# EAGLE design kijelző (EAGLE 6.5.0)
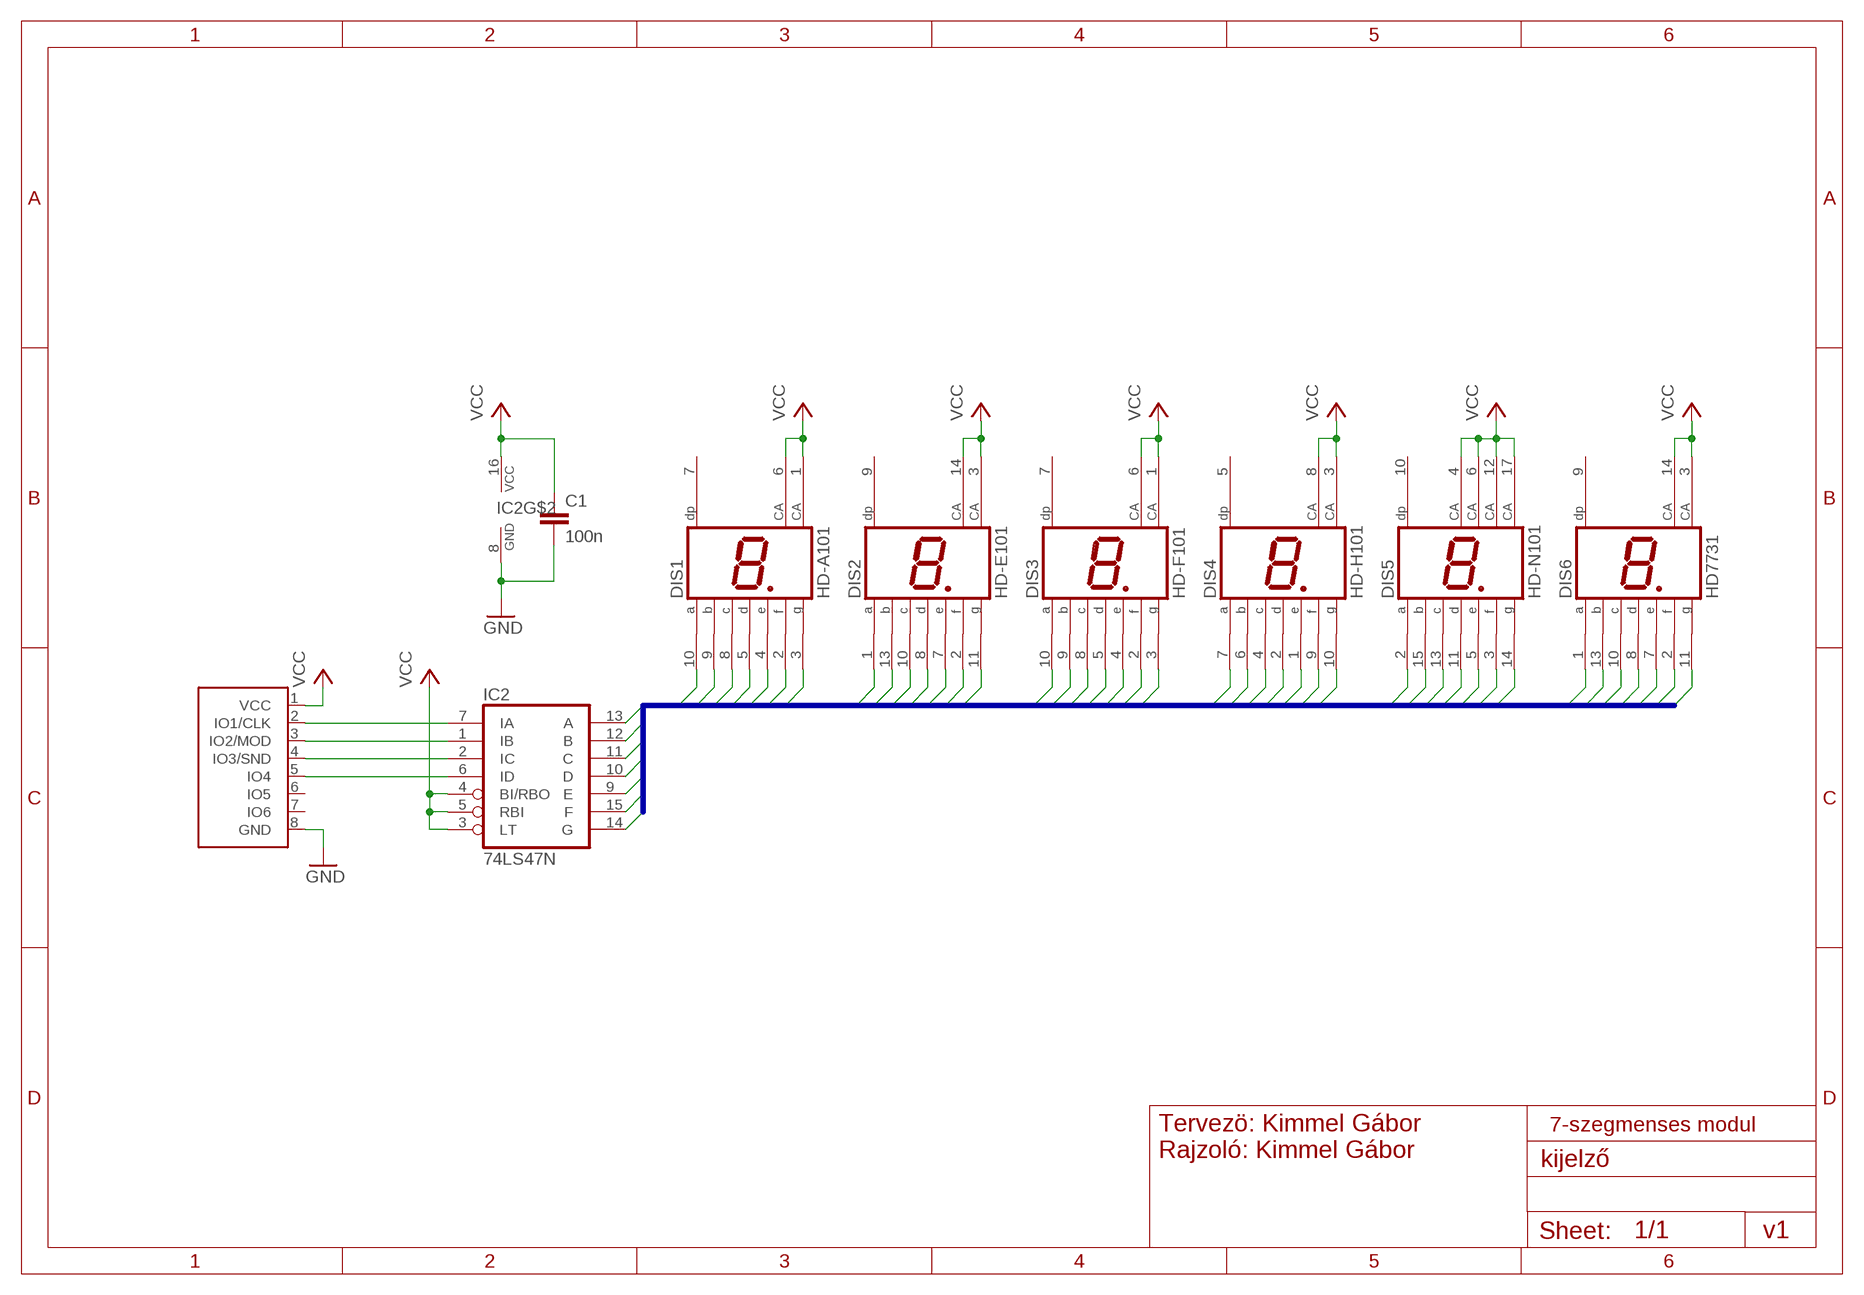
[diagram p0: schematic, sheet 1]

## Parts
C1  100n  C-EU075-032X103  [C075-032X103]
DIS1  HD-A101  [HDSP-A]
DIS2  HD-E101  [HDSP-I]
DIS3  HD-F101  [HDSP-E]
DIS4  HD-H101  [HDSP-M]
DIS5  HD-N101  [HDSP-Q]
DIS6  HD7731  [HD7730]
IC2  74LS47N  [DIL16]
U$1  GANZ-CONNECTOR  [FE08W]

## Nets
A: DIS1.10(A) DIS2.1(A) DIS3.10(A) DIS4.7(A) DIS5.2(A) DIS6.1(A) IC2.13(A)
B: DIS1.9(B) DIS2.13(B) DIS3.9(B) DIS4.6(B) DIS5.15(B) DIS6.13(B) IC2.12(B)
C: DIS1.8(C) DIS2.10(C) DIS3.8(C) DIS4.4(C) DIS5.13(C) DIS6.10(C) IC2.11(C)
D: DIS1.5(D) DIS2.8(D) DIS3.5(D) DIS4.2(D) DIS5.11(D) DIS6.8(D) IC2.10(D)
E: DIS1.4(E) DIS2.7(E) DIS3.4(E) DIS4.1(E) DIS5.5(E) DIS6.7(E) IC2.9(E)
F: DIS1.2(F) DIS2.2(F) DIS3.2(F) DIS4.9(F) DIS5.3(F) DIS6.2(F) IC2.15(F)
G: DIS1.3(G) DIS2.11(G) DIS3.3(G) DIS4.10(G) DIS5.14(G) DIS6.11(G) IC2.14(G)
GND: C1.2 IC2.8(GND) U$1.8(GND)
N$1: IC2.7(IA) U$1.2(IO1/CLK)
N$2: IC2.1(IB) U$1.3(IO2/MOD)
N$3: IC2.2(IC) U$1.4(IO3/SND)
N$4: IC2.6(ID) U$1.5(IO4)
VCC: C1.1 DIS1.1(CA) DIS1.6(CA) DIS2.3(CA) DIS2.14(CA) DIS3.1(CA) DIS3.6(CA) DIS4.3(CA) DIS4.8(CA) DIS5.4(CA) DIS5.6(CA) DIS5.12(CA) DIS5.17(CA) DIS6.3(CA) DIS6.14(CA) IC2.3(LT) IC2.4(BI/RBO) IC2.5(RBI) IC2.16(VCC) U$1.1(VCC)
Unconnected: DIS1.7(DP) DIS2.9(DP) DIS3.7(DP) DIS4.5(DP) DIS5.10(DP) DIS6.9(DP) U$1.6(IO5) U$1.7(IO6)

## Buses
A,B,C,D,E,F,G

## Notes on the sheet
- Tervezö: Kimmel Gábor
  Rajzoló: Kimmel Gábor
- 7-szegmenses modul
- v1

## Library data of the parts
C1 = resistor:C-EU: CAPACITOR, European symbol
DIS1 = display-hp:HD-A101: LED DISPLAY 1-character 7 segment, decimal point right; OC_FARNELL: unknown; OC_NEWARK: unknown
DIS2 = display-hp:HD-E101: LED DISPLAY 1-character 7 segment, decimal point right; OC_FARNELL: unknown; OC_NEWARK: unknown
DIS3 = display-hp:HD-F101: LED DISPLAY 1-character 7 segment, decimal point right; OC_FARNELL: unknown; OC_NEWARK: unknown
DIS4 = display-hp:HD-H101: LED DISPLAY 1-character 7 segment, decimal point right; OC_FARNELL: unknown; OC_NEWARK: unknown
DIS5 = display-hp:HD-N101: LED DISPLAY 1-character 7 segment, decimal point right; OC_FARNELL: unknown; OC_NEWARK: unknown
DIS6 = display-hp:HD7731: LED DISPLAY 1-character 7 segment, decimal point right; OC_FARNELL: unknown; OC_NEWARK: unknown
IC2 = 74xx-eu:74*47: BCD to seven segment DECODER/DRIVER Source: http://www.ee.washington.edu/stores/DataSheets/74ls/74ls47.pdf
U$1 = ganzlib:GANZ-CONNECTOR

## Board
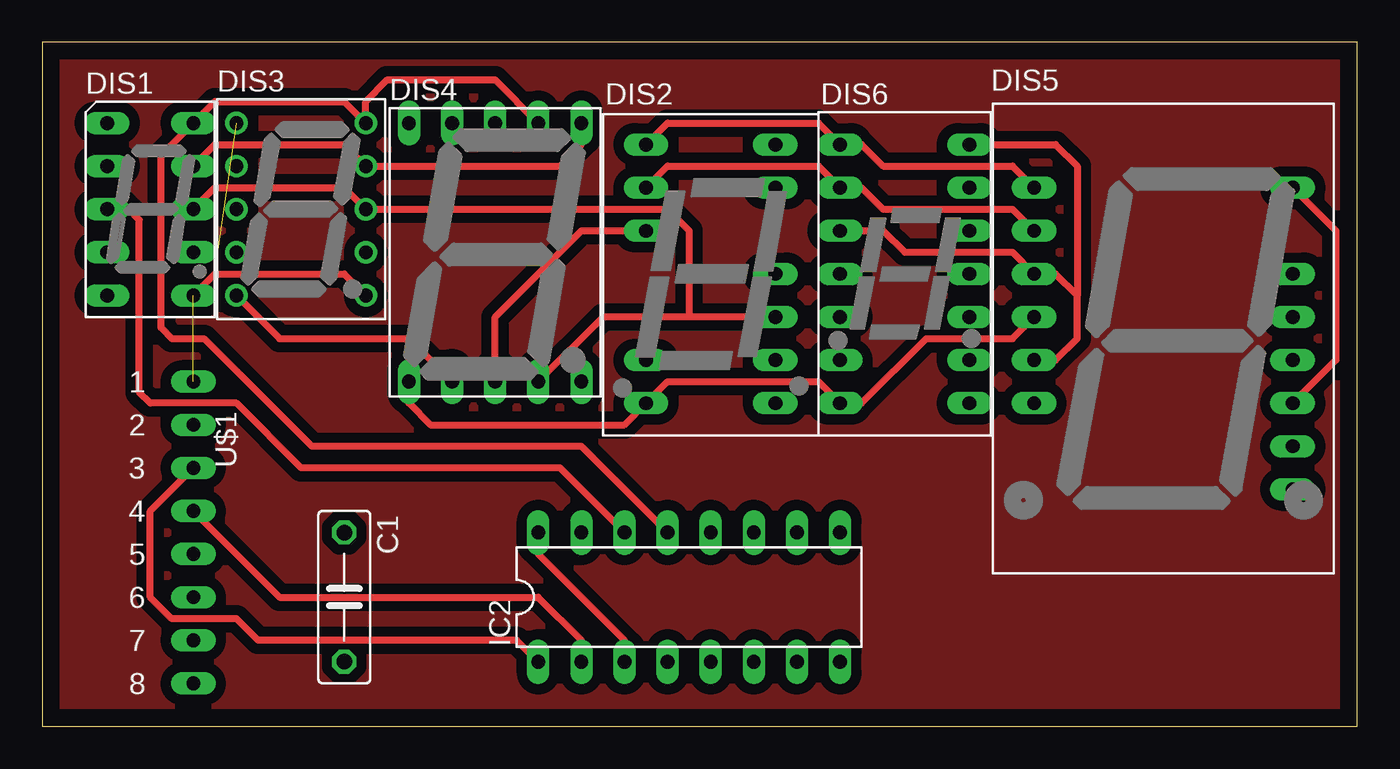
[diagram p1: board, top side]
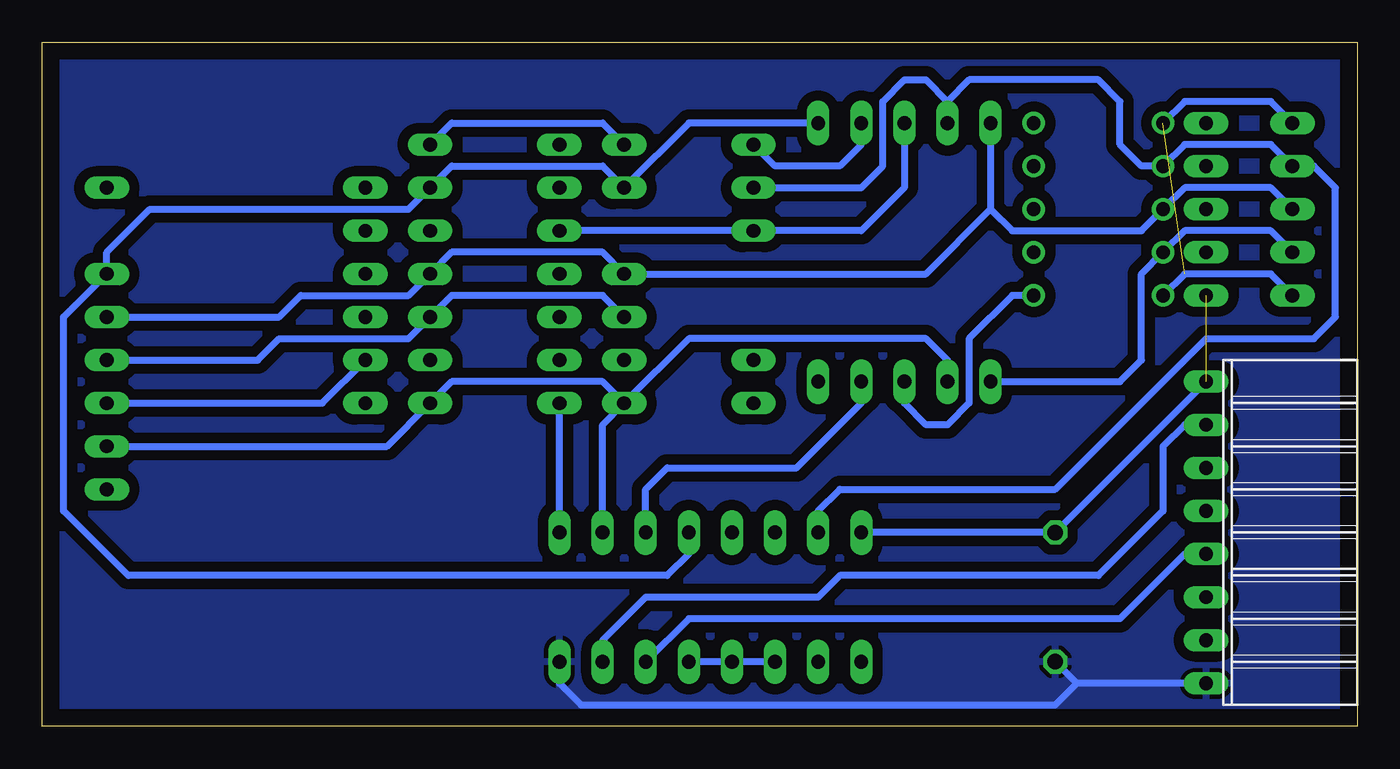
[diagram p2: board, bottom side, seen from below]

Size 77.45 x 40.31 mm. Coordinates in mm from the lower left corner, seen from the top.
Outline: 0,0 77.45,0 77.45,40.31 0,40.31 0,0
Copper layers (1*16): Top 0.035mm / dielectric 1.5mm / Bottom 0.035mm
Design rules "default": minimum track width 10mil, minimum drill 24mil, track to track 8mil, track to pad 8mil, pad to pad 8mil, via to via 8mil, smd to smd 8mil, copper to edge 40mil, drill to drill 8mil, minimum pad ring 10mil, minimum via ring 8mil, stop-mask expansion 4mil, vias tented up to drill 0mil, thermal gap 10mil

### Footprints (pad centres in the part's own frame; a part is rotated, then mirrored left to right if it is on the bottom)
C075-032X103 = drill 0.914 octagon: 1 -3.81,0; 2 3.81,0
HDSP-A = drill 0.813 long: 1 -2.54,5.08; 2 -2.54,2.54; 3 -2.54,0; 4 -2.54,-2.54; 5 -2.54,-5.08; 6 2.54,-5.08; 7 2.54,-2.54; 8 2.54,0; 9 2.54,2.54; 10 2.54,5.08
HDSP-I = drill 0.813 long: 1 -3.81,7.62; 2 -3.81,5.08; 3 -3.81,2.54; 6 -3.81,-5.08; 7 -3.81,-7.62; 8 3.81,-7.62; 9 3.81,-5.08; 10 3.81,-2.54; 11 3.81,0; 13 3.81,5.08; 14 3.81,7.62
HDSP-E = drill 0.813: 1 -3.81,5.08; 2 -3.81,2.54; 3 -3.81,0; 4 -3.81,-2.54; 5 -3.81,-5.08; 6 3.81,-5.08; 7 3.81,-2.54; 8 3.81,0; 9 3.81,2.54; 10 3.81,5.08
HDSP-M = drill 0.813 long: 1 -5.08,-7.62; 2 -2.54,-7.62; 3 0,-7.62; 4 2.54,-7.62; 5 5.08,-7.62; 6 5.08,7.62; 7 2.54,7.62; 8 0,7.62; 9 -2.54,7.62; 10 -5.08,7.62
HDSP-Q = drill 0.813 long: 2 -7.62,8.89; 3 -7.62,6.35; 4 -7.62,3.81; 5 -7.62,1.27; 6 -7.62,-1.27; 7 -7.62,-3.81; 10 7.62,-8.89; 11 7.62,-6.35; 12 7.62,-3.81; 13 7.62,-1.27; 14 7.62,1.27; 15 7.62,3.81; 17 7.62,8.89
HD7730 = drill 0.813 long: 1 -3.81,7.62; 2 -3.81,5.08; 3 -3.81,2.54; 4 -3.81,0; 5 -3.81,-2.54; 6 -3.81,-5.08; 7 -3.81,-7.62; 8 3.81,-7.62; 9 3.81,-5.08; 10 3.81,-2.54; 11 3.81,0; 12 3.81,2.54; 13 3.81,5.08; 14 3.81,7.62
DIL16 = drill 0.813 long: 1 -8.89,-3.81; 2 -6.35,-3.81; 3 -3.81,-3.81; 4 -1.27,-3.81; 5 1.27,-3.81; 6 3.81,-3.81; 7 6.35,-3.81; 8 8.89,-3.81; 9 8.89,3.81; 10 6.35,3.81; 11 3.81,3.81; 12 1.27,3.81; 13 -1.27,3.81; 14 -3.81,3.81; 15 -6.35,3.81; 16 -8.89,3.81
FE08W = drill 0.813 long: 1 0,8.89; 2 0,6.35; 3 0,3.81; 4 0,1.27; 5 0,-1.27; 6 0,-3.81; 7 0,-6.35; 8 0,-8.89

### Placement (x,y rotation side)
C1  17.78,7.62 270 top
DIS1  6.35,30.48 0 top
DIS2  39.37,26.67 0 top
DIS3  15.24,30.48 0 top
DIS4  26.67,27.94 0 top
DIS5  66.04,22.86 0 top
DIS6  50.8,26.67 0 top
IC2  38.1,7.62 0 top
U$1  8.89,11.43 0 top

### Tracks (layer width: path | path; a pad name or v marks a point on that pad's centre or on a via)
A
  Top 0.406: DIS5.2 57.15,33.02 49.53,33.02 48.26,34.29 DIS6.1 45.72,35.56 36.83,35.56 DIS2.1 | DIS4.7 26.67,38.1 20.32,38.1 19.05,36.83 DIS3.10 17.78,36.83 10.16,36.83 DIS1.10 6.99,33.66 6.99,23.5 7.62,22.86 9.53,22.86 15.88,16.51 31.75,16.51 IC2.13
  Bottom 0.406: DIS4.7 29.21,34.29 30.48,33.02 34.29,33.02 DIS2.1
B
  Top 0.406: DIS1.9 10.16,34.29 17.78,34.29 DIS3.9 30.48,33.02 31.75,34.29 DIS4.6
  Bottom 0.406: IC2.12 39.37,10.16 40.64,8.89 72.39,8.89 76.2,12.7 76.2,24.13 DIS5.15 73.66,27.94 71.12,30.48 55.88,30.48 DIS6.13 53.34,33.02 44.45,33.02 DIS2.13 39.37,35.56 DIS4.6
C
  Top 0.406: DIS1.8 10.16,31.75 17.78,31.75 DIS3.8 36.83,30.48 38.1,29.21 38.1,24.13 | DIS2.10 38.1,24.13 | 38.1,24.13 33.02,24.13 DIS4.4
  Bottom 0.406: IC2.11 41.91,13.97 40.64,15.24 33.02,15.24 29.21,19.05 DIS4.4 | DIS5.13 64.77,21.59 63.5,22.86 55.88,22.86 DIS6.10 53.34,25.4 44.45,25.4 DIS2.10
D
  Top 0.406: DIS3.5 13.97,22.86 21.59,22.86 DIS4.2
  Bottom 0.406: IC2.10 44.45,17.78 DIS2.8 | DIS1.5 5.08,26.67 10.16,26.67 DIS3.5 | DIS5.11 57.15,16.51 DIS6.8 53.34,20.32 44.45,20.32 DIS2.8 | DIS4.2 24.13,21.59 25.4,22.86 39.37,22.86 DIS2.8
E
  Top 0.406: DIS5.5 57.15,22.86 52.07,22.86 48.26,19.05 DIS6.7 45.72,20.32 36.83,20.32 DIS2.7 34.29,17.78 22.86,17.78 21.59,19.05 DIS4.1
  Bottom 0.406: IC2.9 DIS6.7 | DIS1.4 5.08,29.21 10.16,29.21 DIS3.4 12.7,26.67 12.7,21.59 13.97,20.32 DIS4.1
F
  Top 0.406: DIS5.3 57.15,30.48 49.53,30.48 48.26,31.75 DIS6.2 45.72,33.02 36.83,33.02 DIS2.2
  Bottom 0.406: IC2.15 31.75,12.7 30.48,13.97 17.78,13.97 8.89,22.86 2.54,22.86 1.27,24.13 1.27,31.75 2.54,33.02 DIS1.2 5.08,34.29 10.16,34.29 DIS3.2 12.7,33.02 13.97,34.29 13.97,36.83 15.24,38.1 22.86,38.1 24.13,36.83 | DIS2.2 29.21,31.75 27.94,33.02 27.94,36.83 26.67,38.1 25.4,38.1 24.13,36.83 | 24.13,36.83 DIS4.9
G
  Top 0.406: IC2.14 30.48,15.24 15.24,15.24 11.43,19.05 6.35,19.05 5.71,19.68 5.71,29.84 5.08,30.48 DIS1.3
  Bottom 0.406: DIS1.3 5.08,31.75 10.16,31.75 DIS3.3 12.7,29.21 20.32,29.21 21.59,30.48 | DIS5.14 63.5,24.13 62.23,25.4 55.88,25.4 DIS6.11 53.34,27.94 44.45,27.94 DIS2.11 25.4,26.67 21.59,30.48 | DIS4.10 21.59,30.48
GND
  Bottom 0.406: U$1.8 16.51,2.54 | 16.51,2.54 C1.2 | IC2.8 46.99,2.54 45.72,1.27 17.78,1.27 16.51,2.54
  pour Bottom (isolate 0.61): 0,40.64 77.47,40.64 77.47,0 0,0
N$1
  Bottom 0.406: U$1.2 10.16,17.78 11.43,16.51 11.43,12.7 15.24,8.89 30.48,8.89 31.75,7.62 41.91,7.62 44.45,5.08 IC2.7
N$2
  Top 0.406: IC2.1 27.94,5.08 12.7,5.08 11.43,6.35 7.62,6.35 6.35,7.62 6.35,12.7 U$1.3
N$3
  Top 0.406: U$1.4 13.97,7.62 29.21,7.62 31.75,5.08 IC2.2
N$4
  Bottom 0.406: U$1.5 10.16,10.16 13.97,6.35 39.37,6.35 IC2.6
N$5
  pour Top (isolate 0.61): 0,0 0,40.64 77.47,40.64 77.47,0
VCC  (2 unrouted)
  Top 0.406: IC2.3 34.29,5.08 29.21,10.16 IC2.16 | DIS1.6 10.16,26.67 17.78,26.67 DIS3.6 | DIS5.17 76.2,29.21 76.2,21.59 DIS5.12 | DIS5.6 59.69,21.59 60.96,22.86 60.96,25.4 | 60.96,25.4 59.69,26.67 DIS5.4 57.15,27.94 50.8,27.94 49.53,29.21 DIS6.3 | DIS6.14 59.69,34.29 60.96,33.02 60.96,25.4 | DIS4.3 26.67,24.13 31.75,29.21 DIS2.3
  Bottom 0.406: U$1.1 C1.1 IC2.16 | IC2.3 IC2.4 IC2.5 | DIS1.1 5.08,36.83 10.16,36.83 DIS3.1 | DIS5.12 60.96,19.05 DIS5.6 | DIS6.14 53.34,35.56 44.45,35.56 DIS2.14 | DIS4.8 26.67,31.75 29.21,29.21 DIS2.3 DIS6.3 | DIS3.6 20.32,25.4 22.86,22.86 22.86,19.05 24.13,17.78 25.4,17.78 26.67,19.05 DIS4.3